# Altium schematic sheet PWRCTRL_RELAY_PWM_28V2A_X4.SchDoc: Power Control or PWM
size A4; DocumentNumber: 11; Revision: 5; SheetNumber: 12; SheetTotal: 77; Organization: Altium Limited.; Address1: Level 3, 12a Rodborough Rd; Address2: Frenchs Forest 2086; Address3: NSW; Address4: AUSTRALIA
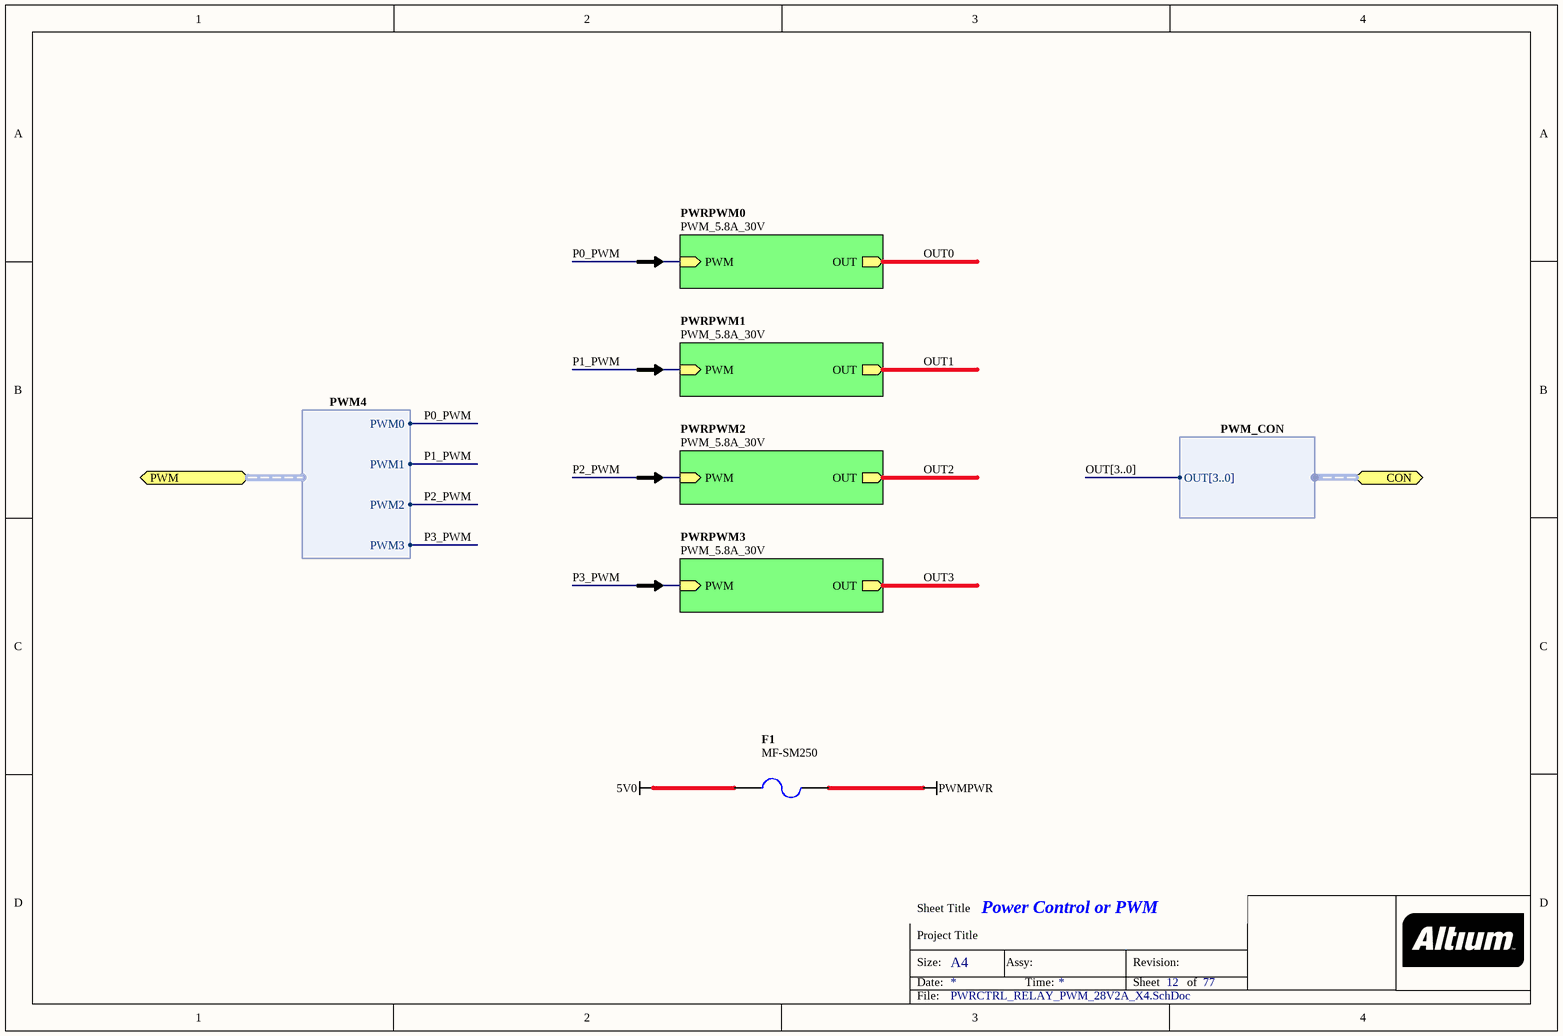
[diagram p0: PWRCTRL_RELAY_PWM_28V2A_X4.SchDoc]

## Parts
F1  MF-SM250  [MF_SM250]

## Sub-sheets
PWRPWM0 = PWM_5.8A_30V: PWM (in), OUT (out)
PWRPWM1 = PWM_5.8A_30V: PWM (in), OUT (out)
PWRPWM2 = PWM_5.8A_30V: PWM (in), OUT (out)
PWRPWM3 = PWM_5.8A_30V: PWM (in), OUT (out)

## Ports
CON (harness PWM_CON), PWM (harness PWM4)

## Harnesses
PWM4: PWM0, PWM1, PWM2, PWM3
PWM_CON: OUT[3..0]

## Nets
5V0: F1.1
PWMPWR: F1.2
OUT0: sheet PWRPWM0/OUT
OUT1: sheet PWRPWM1/OUT
OUT2: sheet PWRPWM2/OUT
OUT3: sheet PWRPWM3/OUT
P0_PWM: sheet PWRPWM0/PWM, port PWM.PWM0
P1_PWM: sheet PWRPWM1/PWM, port PWM.PWM1
P2_PWM: sheet PWRPWM2/PWM, port PWM.PWM2
P3_PWM: sheet PWRPWM3/PWM, port PWM.PWM3

## Buses and harness runs
bus OUT[3..0]

## Notes on the sheet
- Sheet Title
- Project Title
- Size:
- Date:
- A4
- Assy:
- Time:
- Revision:
- Sheet
- of
- File:

## Library data of the parts
F1 = D-106-0000: Mutifuse, SMD 5A; Rated Voltage: 15V; Amperage: 5A; Category: Fuse